# EAGLE schematic remoticon (EAGLE 6.3)
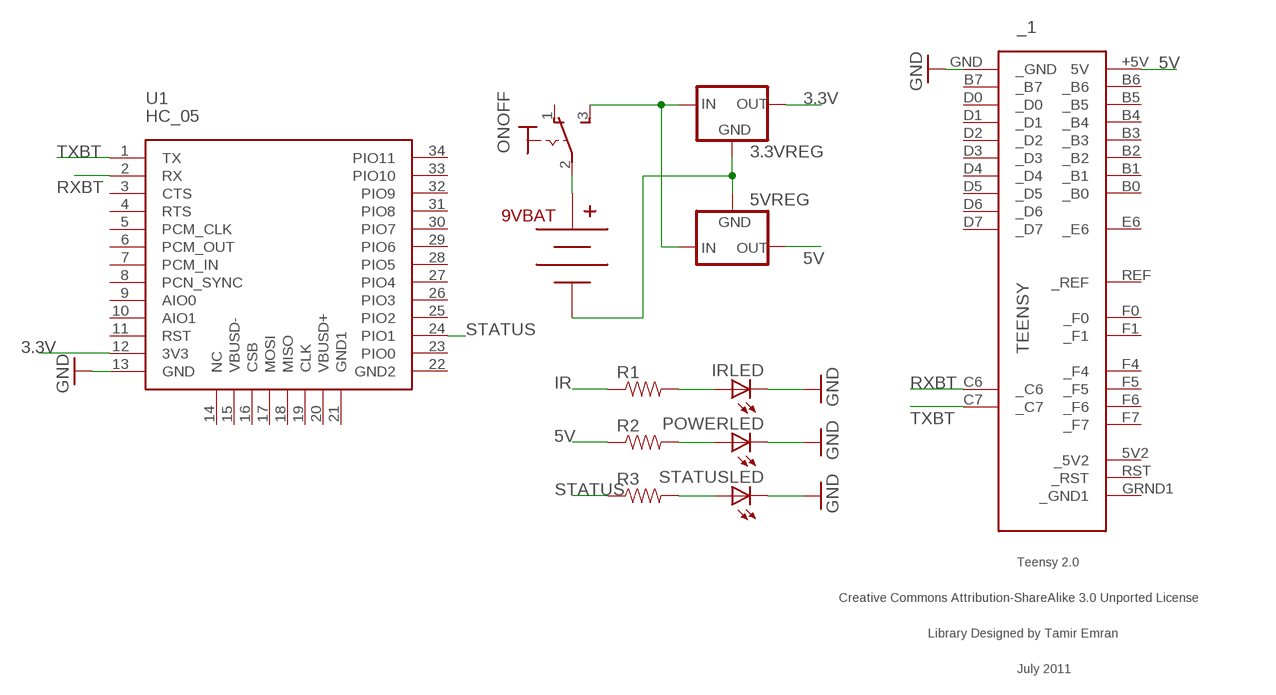
[diagram p0: schematic, sheet 1]

## Parts
3.3VREG  V_REG_LD1117VXX  [78XXL]
5VREG  V_REG_78XX-TO-220  [TO-220-ALT]
9VBAT  BC9VPC  [BC9VPC]
_1  TEENSY  [TEENSY]
IRLED  LED5MM  [LED5MM]
ONOFF  320-916  [320-916]
POWERLED  LED5MM  [LED5MM]
R1  RESISTOREZ  [AXIAL-0.3EZ]
R2  RESISTOREZ  [AXIAL-0.3EZ]
R3  RESISTOREZ  [AXIAL-0.3EZ]
STATUSLED  LED5MM  [LED5MM]
U1  HC_05  [BLUETOOTH_SMD]

## Nets
3.3V: 3.3VREG.GND(OUT) U1.12(3V3)
5V: 5VREG.OUT _1.+5V(5V) R2.P$1
GND: _1.GND(_GND) IRLED.K(C) POWERLED.K(C) STATUSLED.K(C) U1.13(GND)
IR: R1.P$1
N$1: 9VBAT.V+ ONOFF.2(P)
N$2: 3.3VREG.OUT(IN) 5VREG.IN ONOFF.3(S)
N$3: 3.3VREG.IN(GND) 5VREG.GND 9VBAT.V-
N$4: IRLED.A R1.P$2
N$5: POWERLED.A R2.P$2
N$6: R3.P$2 STATUSLED.A
RXBT: _1.C6(_C6) U1.2(RX)
STATUS: R3.P$1 U1.24(PIO1)
TXBT: _1.C7(_C7) U1.1(TX)
Unconnected: _1.5V2(_5V2) _1.B0(_B0) _1.B1(_B1) _1.B2(_B2) _1.B3(_B3) _1.B4(_B4) _1.B5(_B5) _1.B6(_B6) _1.B7(_B7) _1.D0(_D0) _1.D1(_D1) _1.D2(_D2) _1.D3(_D3) _1.D4(_D4) _1.D5(_D5) _1.D6(_D6) _1.D7(_D7) _1.E6(_E6) _1.F0(_F0) _1.F1(_F1) _1.F4(_F4) _1.F5(_F5) _1.F6(_F6) _1.F7(_F7) _1.GRND1(_GND1) _1.REF(_REF) _1.RST(_RST) ONOFF.1(O) U1.3(CTS) U1.4(RTS) U1.5(PCM_CLK) U1.6(PCM_OUT) U1.7(PCM_IN) U1.8(PCN_SYNC) U1.9(AIO0) U1.10(AIO1) U1.11(RST) U1.14(NC) U1.15(VBUSD-) U1.16(CSB) U1.17(MOSI) U1.18(MISO) U1.19(CLK) U1.20(VBUSD+) U1.21(GND1) U1.22(GND2) U1.23(PIO0) U1.25(PIO2) U1.26(PIO3) U1.27(PIO4) U1.28(PIO5) U1.29(PIO6) U1.30(PIO7) U1.31(PIO8) U1.32(PIO9) U1.33(PIO10) U1.34(PIO11)

## Library data of the parts
3.3VREG = SparkFun-PowerIC:V_REG_LD1117VXX: LD1117VXX voltage regulator. We carry the 3.3V version (COM-00526) in TO-220 package.
5VREG = SparkFun-PowerIC:V_REG_78XX: Voltage Regulator Standard 7805 5V regulator. IGO (Input Ground Output). Spark Fun Electronics SKU : COM-00107
9VBAT = SparkFun-Connectors:BC9VPC: 9V board-mount battery cradle
_1 = teensy:TEENSY: Teensy 2.0 Original Design by Clint Fisher Modified Design by Tamir Emran Licensed Under Creative Commons Attribution-ShareAlike 3.0 Unported (CC BY-SA 3.0)
IRLED POWERLED STATUSLED = adafruit:LED: LED OSRAM: - CHIPLED LG R971, LG N971, LY N971, LG Q971, LY Q971, LO R971, LY R971 LH N974, LH R974 LS Q976, LO Q976, LY Q976 LO Q996 - Hyper CHIPLED LW Q18S LB Q993, LB Q99A, LB R99A - SideLED LS A670, LO A670, LY A670, LG A670, LP A670 LB A673, LV A673, LT A673, LW A673 LH A674 LY A675 LS A676, LA A676, LO A676, LY A676, LW A676 LS A679, LY A679, LG A679 - Hyper Micro SIDELED® LS Y876, LA Y876, LO Y876, LY Y876 LT Y87S - SmartLED LW L88C, LW L88S LB L89C, LB L89S, LG L890 LS L89K, LO L89K, LY L89K LS L896, LA L896, LO L896, LY L896 - TOPLED LS T670, LO T670, LY T670, LG T670, LP T670 LSG T670, LSP T670, LSY T670, LOP T670, LYG T670 LG T671, LOG T671, LSG T671 LB T673, LV T673, LT T673, LW T673 LH T674 LS T676, LA T676, LO T676, LY T676, LB T676, LH T676, LSB T676, LW T676 LB T67C, LV T67C, LT T67C, LS T67K, LO T67K, LY T67K, LW E67C LS E67B, LA E67B, LO E67B, LY E67B, LB E67C, LV E67C, LT E67C LW T67C LS T679, LY T679, LG T679 LS T770, LO T770, LY T770, LG T770, LP T770 LB T773, LV T773, LT T773, LW T773 LH T774 LS E675, LA E675, LY E675, LS T675 LS T776, LA T776, LO T776, LY T776, LB T776 LHGB T686 LT T68C, LB T68C - Hyper Mini TOPLED® LB M676 - Mini TOPLED Santana® LG M470 LS M47K, LO M47K, LY M47K Source: http://www.osram.convergy.de/
ONOFF = switch:320-916: TOGGLE SWITCH distributor RS Components
R1-R3 = SparkFun-Resistors:RESISTOR: Resistor Basic schematic elements and footprints for 0603, 1206, and PTH resistors.
U1 = SerialPortBluetooth:HC_05